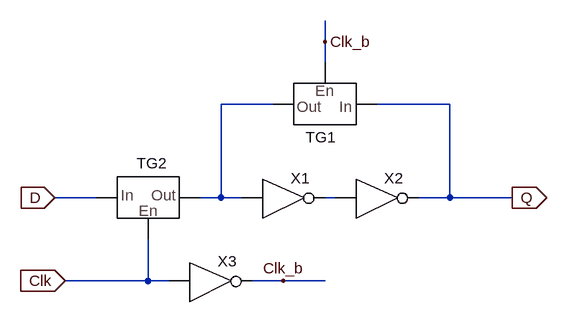
[diagram p0: schematic Latch.asc]
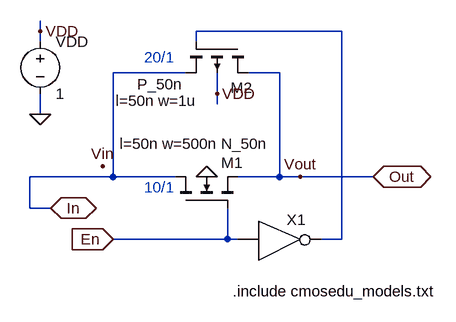
[diagram p1: sub-circuit tg.asc]
Latch.asc, the LTspice schematic file:
Version 4
SHEET 1 1820 680
WIRE 416 -640 416 -672
WIRE 416 -608 416 -640
WIRE 336 -544 256 -544
WIRE 608 -544 496 -544
WIRE 64 -400 0 -400
WIRE 256 -400 256 -544
WIRE 256 -400 224 -400
WIRE 288 -400 256 -400
WIRE 432 -400 416 -400
WIRE 608 -400 608 -544
WIRE 608 -400 560 -400
WIRE 704 -400 608 -400
WIRE 144 -272 144 -336
WIRE 144 -272 16 -272
WIRE 176 -272 144 -272
WIRE 352 -272 304 -272
WIRE 416 -272 352 -272
FLAG 704 -400 Q
IOPIN 704 -400 Out
FLAG 0 -400 D
IOPIN 0 -400 In
FLAG 16 -272 Clk
IOPIN 16 -272 In
FLAG 352 -272 Clk_b
FLAG 416 -640 Clk_b
SYMBOL TG 144 -400 R0
WINDOW 0 -18 -53 Left 2
SYMATTR InstName TG2
SYMBOL NOT 320 -432 R0
SYMATTR InstName X1
SYMBOL NOT 464 -432 R0
SYMATTR InstName X2
SYMBOL NOT 208 -304 R0
SYMATTR InstName X3
SYMBOL TG 416 -544 R180
WINDOW 0 -18 -51 Left 2
SYMATTR InstName TG1

tg.asc, the sub-circuit schematic file:
Version 4
SHEET 1 1136 680
WIRE 160 -336 160 -352
WIRE 624 -336 400 -336
WIRE 160 -320 160 -336
WIRE 400 -320 400 -336
WIRE 384 -272 272 -272
WIRE 528 -272 480 -272
WIRE 432 -240 432 -272
WIRE 432 -224 432 -240
WIRE 160 -208 160 -240
WIRE 272 -112 144 -112
WIRE 272 -112 272 -272
WIRE 368 -112 272 -112
WIRE 528 -112 528 -272
WIRE 528 -112 464 -112
WIRE 560 -112 528 -112
WIRE 672 -112 560 -112
WIRE 144 -64 144 -112
WIRE 176 -64 144 -64
WIRE 448 -16 448 -64
WIRE 448 -16 272 -16
WIRE 464 -16 448 -16
WIRE 624 -16 624 -336
WIRE 624 -16 592 -16
FLAG 560 -112 Vout
FLAG 256 -128 Vin
FLAG 416 -112 0
FLAG 160 -208 0
FLAG 160 -336 VDD
FLAG 432 -240 VDD
FLAG 672 -112 Out
IOPIN 672 -112 BiDir
FLAG 176 -64 In
IOPIN 176 -64 BiDir
FLAG 272 -16 En
IOPIN 272 -16 In
SYMBOL nmos4 368 -64 R270
WINDOW 0 70 70 VRight 2
WINDOW 3 99 70 VRight 2
WINDOW 123 99 -86 VRight 2
SYMATTR InstName M1
SYMATTR Value N_50n
SYMATTR Value2 l=50n w=500n
SYMBOL voltage 160 -336 R0
WINDOW 123 0 0 Left 2
WINDOW 39 0 0 Left 2
SYMATTR InstName VDD
SYMATTR Value 1
SYMBOL pmos4 480 -320 R90
WINDOW 0 71 -7 VRight 2
WINDOW 3 66 101 VRight 2
WINDOW 123 91 79 VRight 2
SYMATTR InstName M2
SYMATTR Value P_50n
SYMATTR Value2 l=50n w=1u
SYMBOL NOT 496 -48 R0
SYMATTR InstName X1
TEXT 456 64 Left 2 !.include cmosedu_models.txt
TEXT 320 -296 Left 2 ;20/1
TEXT 320 -96 Left 2 ;10/1

The netlist it stands for:
* Latch.asc
XTG2 D N001 Clk tg
XX1 N001 N002 NOT  ; pins In Out
XX2 N002 Q NOT  ; pins In Out
XX3 Clk Clk_b NOT  ; pins In Out
XTG1 Q N001 Clk_b tg

* block symbol definitions
.subckt tg In Out En
M1 In En Out 0 N_50n l=50n w=500n
VDD VDD 0 1
M2 Out N001 In VDD P_50n l=50n w=1u
XX1 En N001 NOT  ; pins In Out
.include cmosedu_models.txt
* 20/1
* 10/1
.ends tg

.model NMOS NMOS
.model PMOS PMOS
.lib standard.mos
.backanno
.end